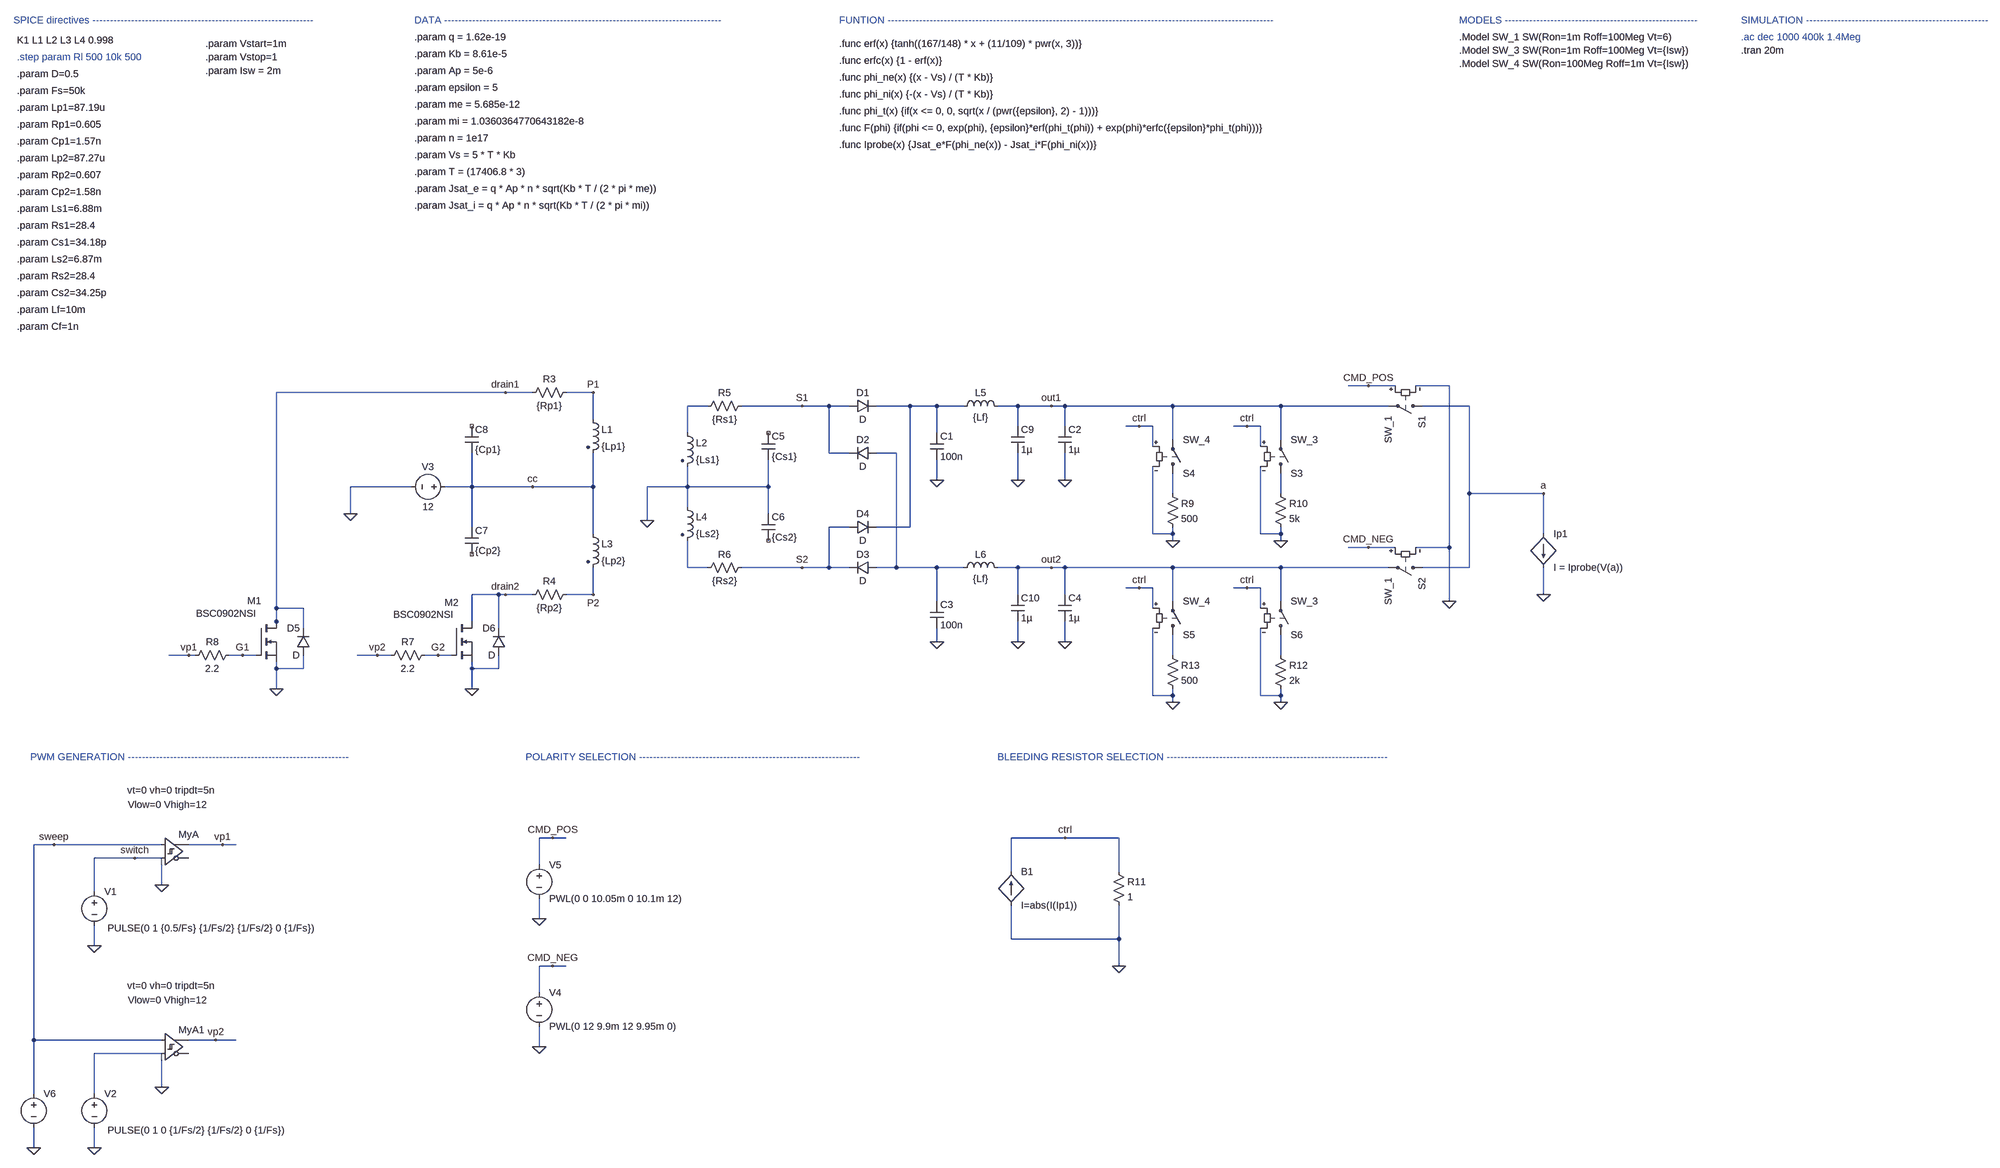
[diagram p0: schematic 6-probe_bps.asc]
6-probe_bps.asc, the LTspice schematic file:
Version 4.1
SHEET 1 4388 4032
WIRE 2064 592 2016 592
WIRE 2128 592 2064 592
WIRE 2256 592 2176 592
WIRE 16 608 -528 608
WIRE 80 608 16 608
WIRE 224 608 160 608
WIRE 496 640 448 640
WIRE 720 640 576 640
WIRE 784 640 720 640
WIRE 832 640 784 640
WIRE 976 640 896 640
WIRE 1040 640 976 640
WIRE 1104 640 1040 640
WIRE 1232 640 1184 640
WIRE 1312 640 1232 640
WIRE 1344 640 1312 640
WIRE 1600 640 1344 640
WIRE 1856 640 1600 640
WIRE 2112 640 1856 640
WIRE 2304 640 2192 640
WIRE 224 672 224 608
WIRE 1232 688 1232 640
WIRE 1344 688 1344 640
WIRE 1520 688 1488 688
WIRE 1552 688 1520 688
WIRE 1776 688 1744 688
WIRE 1808 688 1776 688
WIRE 448 704 448 640
WIRE 1040 704 1040 640
WIRE 1600 720 1600 640
WIRE 1856 720 1856 640
WIRE 1552 736 1552 688
WIRE 1808 736 1808 688
WIRE 784 752 784 640
WIRE 832 752 784 752
WIRE 944 752 896 752
WIRE 1040 816 1040 768
WIRE 1232 816 1232 752
WIRE 1344 816 1344 752
WIRE -208 832 -352 832
WIRE -64 832 -64 752
WIRE -64 832 -128 832
WIRE 80 832 -64 832
WIRE 224 832 224 752
WIRE 224 832 80 832
WIRE 448 832 448 784
WIRE 448 832 352 832
WIRE 640 832 640 768
WIRE 640 832 448 832
WIRE 1600 848 1600 800
WIRE 1856 848 1856 800
WIRE 2304 848 2304 640
WIRE 2480 848 2304 848
WIRE 448 880 448 832
WIRE -352 896 -352 832
WIRE 640 896 640 832
WIRE 352 912 352 832
WIRE -64 928 -64 832
WIRE 832 928 784 928
WIRE 976 928 976 640
WIRE 976 928 896 928
WIRE 224 944 224 832
WIRE 1552 944 1552 784
WIRE 1600 944 1600 928
WIRE 1600 944 1552 944
WIRE 1808 944 1808 784
WIRE 1856 944 1856 928
WIRE 1856 944 1808 944
WIRE 2480 944 2480 848
WIRE 1600 960 1600 944
WIRE 1856 960 1856 944
WIRE 2064 976 2016 976
WIRE 2128 976 2064 976
WIRE 2256 976 2256 592
WIRE 2256 976 2176 976
WIRE 448 1024 448 960
WIRE 496 1024 448 1024
WIRE 720 1024 576 1024
WIRE 784 1024 784 928
WIRE 784 1024 720 1024
WIRE 832 1024 784 1024
WIRE 944 1024 944 752
WIRE 944 1024 896 1024
WIRE 1040 1024 944 1024
WIRE 1104 1024 1040 1024
WIRE 1232 1024 1184 1024
WIRE 1312 1024 1232 1024
WIRE 1344 1024 1312 1024
WIRE 1600 1024 1344 1024
WIRE 1856 1024 1600 1024
WIRE 2112 1024 1856 1024
WIRE 2304 1024 2304 848
WIRE 2304 1024 2192 1024
WIRE 1520 1072 1488 1072
WIRE 1552 1072 1520 1072
WIRE 1776 1072 1744 1072
WIRE 1808 1072 1776 1072
WIRE 0 1088 -64 1088
WIRE 16 1088 0 1088
WIRE 80 1088 16 1088
WIRE 224 1088 224 1024
WIRE 224 1088 160 1088
WIRE 1232 1088 1232 1024
WIRE 1344 1088 1344 1024
WIRE 2480 1088 2480 1024
WIRE 1040 1104 1040 1024
WIRE 1600 1104 1600 1024
WIRE 1856 1104 1856 1024
WIRE 2256 1104 2256 976
WIRE -528 1120 -528 608
WIRE -464 1120 -528 1120
WIRE 1552 1120 1552 1072
WIRE 1808 1120 1808 1072
WIRE -528 1152 -528 1120
WIRE -64 1152 -64 1088
WIRE -528 1168 -528 1152
WIRE -464 1168 -464 1120
WIRE 0 1168 0 1088
WIRE 1040 1200 1040 1168
WIRE 1232 1200 1232 1152
WIRE 1344 1200 1344 1152
WIRE -736 1232 -784 1232
WIRE -720 1232 -736 1232
WIRE -608 1232 -640 1232
WIRE -576 1232 -608 1232
WIRE -288 1232 -336 1232
WIRE -256 1232 -288 1232
WIRE -144 1232 -176 1232
WIRE -112 1232 -144 1232
WIRE 1600 1232 1600 1184
WIRE 1856 1232 1856 1184
WIRE -528 1264 -528 1248
WIRE -464 1264 -464 1232
WIRE -464 1264 -528 1264
WIRE -64 1264 -64 1248
WIRE 0 1264 0 1232
WIRE 0 1264 -64 1264
WIRE -528 1312 -528 1264
WIRE -64 1312 -64 1264
WIRE 1552 1328 1552 1168
WIRE 1600 1328 1600 1312
WIRE 1600 1328 1552 1328
WIRE 1808 1328 1808 1168
WIRE 1856 1328 1856 1312
WIRE 1856 1328 1808 1328
WIRE 1600 1344 1600 1328
WIRE 1856 1344 1856 1328
WIRE 128 2016 96 2016
WIRE 160 2016 128 2016
WIRE 1344 2016 1216 2016
WIRE 1472 2016 1344 2016
WIRE -1056 2032 -1104 2032
WIRE -800 2032 -1056 2032
WIRE -656 2032 -736 2032
WIRE -624 2032 -656 2032
WIRE -864 2064 -960 2064
WIRE -800 2064 -864 2064
WIRE 96 2080 96 2016
WIRE 1216 2096 1216 2016
WIRE 1472 2096 1472 2016
WIRE -800 2128 -800 2080
WIRE -960 2144 -960 2064
WIRE 96 2208 96 2160
WIRE 1216 2256 1216 2176
WIRE 1472 2256 1472 2176
WIRE 1472 2256 1216 2256
WIRE -960 2272 -960 2224
WIRE 128 2320 96 2320
WIRE 160 2320 128 2320
WIRE 1472 2320 1472 2256
WIRE 96 2384 96 2320
WIRE -1104 2496 -1104 2032
WIRE -800 2496 -1104 2496
WIRE -672 2496 -736 2496
WIRE -624 2496 -672 2496
WIRE 96 2512 96 2464
WIRE -800 2528 -960 2528
WIRE -800 2608 -800 2544
WIRE -1104 2624 -1104 2496
WIRE -960 2624 -960 2528
WIRE -1104 2752 -1104 2704
WIRE -960 2752 -960 2704
FLAG 224 608 P1
FLAG 224 1088 P2
FLAG 352 912 0
FLAG -528 1312 0
FLAG -64 1312 0
FLAG -352 896 0
FLAG 16 608 drain1
FLAG 16 1088 drain2
FLAG -608 1232 G1
FLAG -144 1232 G2
FLAG 80 832 cc
FLAG 720 640 S1
FLAG 720 1024 S2
FLAG 1232 816 0
FLAG 1232 1200 0
FLAG -960 2272 0
FLAG -800 2128 0
FLAG -1056 2032 sweep
FLAG -864 2064 switch
FLAG -736 1232 vp1
FLAG -288 1232 vp2
FLAG -656 2032 vp1
FLAG -672 2496 vp2
FLAG 1312 640 out1
FLAG 1312 1024 out2
FLAG -800 2608 0
FLAG -960 2752 0
FLAG 2480 1088 0
FLAG 96 2208 0
FLAG 128 2016 CMD_POS
FLAG 2256 1104 0
FLAG 2064 592 CMD_POS
FLAG 2480 848 a
FLAG -1104 2752 0
FLAG 1472 2320 0
FLAG 1344 2016 ctrl
FLAG 1520 688 ctrl
FLAG 1776 688 ctrl
FLAG 1520 1072 ctrl
FLAG 1776 1072 ctrl
FLAG 1600 1344 0
FLAG 1856 1344 0
FLAG 1856 960 0
FLAG 1600 960 0
FLAG 96 2512 0
FLAG 128 2320 CMD_NEG
FLAG 2064 976 CMD_NEG
FLAG 1040 1200 0
FLAG 1040 816 0
FLAG 1344 816 0
FLAG 1344 1200 0
SYMBOL ind2 208 656 R0
SYMATTR InstName L1
SYMATTR Value {Lp1}
SYMATTR Type ind
SYMBOL ind2 432 688 R0
SYMATTR InstName L2
SYMATTR Value {Ls1}
SYMATTR Type ind
SYMBOL ind2 208 928 R0
SYMATTR InstName L3
SYMATTR Value {Lp2}
SYMATTR Type ind
SYMBOL ind2 432 864 R0
SYMATTR InstName L4
SYMATTR Value {Ls2}
SYMATTR Type ind
SYMBOL diode 832 656 R270
WINDOW 0 32 32 VTop 2
WINDOW 3 0 32 VBottom 2
SYMATTR InstName D1
SYMBOL diode 896 736 R90
WINDOW 0 0 32 VBottom 2
WINDOW 3 32 32 VTop 2
SYMATTR InstName D2
SYMBOL diode 896 1008 R90
WINDOW 0 0 32 VBottom 2
WINDOW 3 32 32 VTop 2
SYMATTR InstName D3
SYMBOL diode 832 944 R270
WINDOW 0 32 32 VTop 2
WINDOW 3 0 32 VBottom 2
SYMATTR InstName D4
SYMBOL cap 1024 704 R0
SYMATTR InstName C1
SYMATTR Value 100n
SYMBOL cap 1024 1104 R0
SYMATTR InstName C3
SYMATTR Value 100n
SYMBOL res 176 592 R90
WINDOW 0 0 56 VBottom 2
WINDOW 3 32 56 VTop 2
SYMATTR InstName R3
SYMATTR Value {Rp1}
SYMBOL res 176 1072 R90
WINDOW 0 0 56 VBottom 2
WINDOW 3 32 56 VTop 2
SYMATTR InstName R4
SYMATTR Value {Rp2}
SYMBOL res 592 624 R90
WINDOW 0 0 56 VBottom 2
WINDOW 3 32 56 VTop 2
SYMATTR InstName R5
SYMATTR Value {Rs1}
SYMBOL res 592 1008 R90
WINDOW 0 0 56 VBottom 2
WINDOW 3 32 56 VTop 2
SYMATTR InstName R6
SYMATTR Value {Rs2}
SYMBOL cap 624 704 R0
SYMATTR InstName C5
SYMATTR Value {Cs1}
SYMBOL cap 624 896 R0
SYMATTR InstName C6
SYMATTR Value {Cs2}
SYMBOL voltage -960 2128 R0
WINDOW 3 31 102 Left 2
WINDOW 123 0 0 Left 0
WINDOW 39 24 46 Left 2
SYMATTR Value PULSE(0 1 {0.5/Fs} {1/Fs/2} {1/Fs/2} 0 {1/Fs})
SYMATTR InstName V1
SYMBOL voltage -112 832 R90
WINDOW 0 -32 56 VBottom 2
WINDOW 3 32 56 VTop 2
WINDOW 123 0 0 Left 0
WINDOW 39 0 0 Left 0
SYMATTR InstName V3
SYMATTR Value 12
SYMBOL nmos -576 1152 R0
WINDOW 0 -21 -49 Left 2
WINDOW 3 -143 -19 Left 2
SYMATTR InstName M1
SYMATTR Value BSC0902NSI
SYMBOL nmos -112 1152 R0
WINDOW 0 -17 -45 Left 2
WINDOW 3 -138 -17 Left 2
SYMATTR InstName M2
SYMATTR Value BSC0902NSI
SYMBOL res -160 1216 R90
WINDOW 0 0 56 VBottom 2
WINDOW 3 32 56 VTop 2
SYMATTR InstName R7
SYMATTR Value 2.2
SYMBOL res -624 1216 R90
WINDOW 0 0 56 VBottom 2
WINDOW 3 32 56 VTop 2
SYMATTR InstName R8
SYMATTR Value 2.2
SYMBOL cap -80 928 R0
SYMATTR InstName C7
SYMATTR Value {Cp2}
SYMBOL cap -80 688 R0
SYMATTR InstName C8
SYMATTR Value {Cp1}
SYMBOL diode -448 1232 R180
WINDOW 0 24 64 Left 2
WINDOW 3 24 0 Left 2
SYMATTR InstName D5
SYMBOL diode 16 1232 R180
WINDOW 0 24 64 Left 2
WINDOW 3 24 0 Left 2
SYMATTR InstName D6
SYMBOL ind 1088 656 R270
WINDOW 0 32 56 VTop 2
WINDOW 3 5 56 VBottom 2
SYMATTR InstName L5
SYMATTR Value {Lf}
SYMBOL ind 1088 1040 R270
WINDOW 0 32 56 VTop 2
WINDOW 3 5 56 VBottom 2
SYMATTR InstName L6
SYMATTR Value {Lf}
SYMBOL cap 1216 688 R0
SYMATTR InstName C9
SYMATTR Value 1µ
SYMBOL cap 1216 1088 R0
SYMATTR InstName C10
SYMATTR Value 1µ
SYMBOL Digital\\diffschmitt -800 1984 R0
WINDOW 3 -82 -81 Left 2
WINDOW 123 -80 -47 Left 2
SYMATTR Value vt=0 vh=0 tripdt=5n
SYMATTR Value2 Vlow=0 Vhigh=12
SYMATTR InstName MyA
SYMBOL Digital\\diffschmitt -800 2448 R0
WINDOW 3 -82 -81 Left 2
WINDOW 123 -80 -47 Left 2
SYMATTR Value vt=0 vh=0 tripdt=5n
SYMATTR Value2 Vlow=0 Vhigh=12
SYMATTR InstName MyA1
SYMBOL voltage -960 2608 R0
WINDOW 3 31 102 Left 2
WINDOW 123 0 0 Left 0
WINDOW 39 24 46 Left 2
SYMATTR Value PULSE(0 1 0 {1/Fs/2} {1/Fs/2} 0 {1/Fs})
SYMATTR InstName V2
SYMBOL bi 2480 944 R0
SYMATTR InstName Ip1
SYMATTR Value I = Iprobe(V(a))
SYMBOL voltage 96 2064 R0
WINDOW 123 0 0 Left 0
WINDOW 39 0 0 Left 0
SYMATTR InstName V5
SYMATTR Value PWL(0 0 10.05m 0 10.1m 12)
SYMBOL sw 2208 640 R90
SYMATTR InstName S1
SYMATTR Value SW_1
SYMBOL sw 2208 1024 R90
SYMATTR InstName S2
SYMATTR Value SW_1
SYMBOL voltage -1104 2608 R0
WINDOW 123 0 0 Left 0
WINDOW 39 0 0 Left 0
WINDOW 3 24 96 Invisible 2
SYMATTR Value PWL(0 {Vstart} 3.4m {0.499*Vstop} 4m {Vstart} 10m {Vstart} 13.4m {0.499*Vstop} 14m {Vstart})
SYMATTR InstName V6
SYMBOL bi2 1216 2096 R0
SYMATTR InstName B1
SYMATTR Value I=abs(I(Ip1))
SYMBOL res 1456 2080 R0
SYMATTR InstName R11
SYMATTR Value 1
SYMBOL sw 1600 816 M180
SYMATTR InstName S4
SYMATTR Value SW_4
SYMBOL sw 1856 816 M180
SYMATTR InstName S3
SYMATTR Value SW_3
SYMBOL sw 1600 1200 M180
SYMATTR InstName S5
SYMATTR Value SW_4
SYMBOL sw 1856 1200 M180
SYMATTR InstName S6
SYMATTR Value SW_3
SYMBOL res 1584 832 R0
SYMATTR InstName R9
SYMATTR Value 500
SYMBOL res 1840 832 R0
SYMATTR InstName R10
SYMATTR Value 5k
SYMBOL res 1840 1216 R0
SYMATTR InstName R12
SYMATTR Value 2k
SYMBOL res 1584 1216 R0
SYMATTR InstName R13
SYMATTR Value 500
SYMBOL voltage 96 2368 R0
WINDOW 123 0 0 Left 0
WINDOW 39 0 0 Left 0
SYMATTR InstName V4
SYMATTR Value PWL(0 12 9.9m 12 9.95m 0)
SYMBOL cap 1328 688 R0
SYMATTR InstName C2
SYMATTR Value 1µ
SYMBOL cap 1328 1088 R0
SYMATTR InstName C4
SYMATTR Value 1µ
TEXT -1152 -480 Left 2 ;SPICE directives ---------------------------------------------------------------
TEXT 3144 -440 Left 2 ;.ac dec 1000 400k 1.4Meg
TEXT 3144 -480 Left 2 ;SIMULATION ----------------------------------------------------
TEXT 3144 -408 Left 2 !.tran 20m
TEXT -1144 -432 Left 2 !K1 L1 L2 L3 L4 0.998
TEXT -1144 -272 Left 2 !.param Lp1=87.19u
TEXT -1144 -192 Left 2 !.param Cp1=1.57n
TEXT -1144 -232 Left 2 !.param Rp1=0.605
TEXT -1144 -152 Left 2 !.param Lp2=87.27u
TEXT -1144 -72 Left 2 !.param Cp2=1.58n
TEXT -1144 -112 Left 2 !.param Rp2=0.607
TEXT -1144 -32 Left 2 !.param Ls1=6.88m
TEXT -1144 48 Left 2 !.param Cs1=34.18p
TEXT -1144 8 Left 2 !.param Rs1=28.4
TEXT -1144 88 Left 2 !.param Ls2=6.87m
TEXT -1144 168 Left 2 !.param Cs2=34.25p
TEXT -1144 128 Left 2 !.param Rs2=28.4
TEXT -1144 -312 Left 2 !.param Fs=50k
TEXT -1144 -352 Left 2 !.param D=0.5
TEXT -1144 -392 Left 2 ;.step param Rl 500 10k 500
TEXT -1144 208 Left 2 !.param Lf=10m
TEXT -1144 248 Left 2 !.param Cf=1n
TEXT 808 -224 Left 2 !.func F(phi) {if(phi <= 0, exp(phi), {epsilon}*erf(phi_t(phi)) + exp(phi)*erfc({epsilon}*phi_t(phi)))}
TEXT 808 -424 Left 2 !.func erf(x) {tanh((167/148) * x + (11/109) * pwr(x, 3))}
TEXT 808 -480 Left 2 ;FUNTION --------------------------------------------------------------------------------------------------------------
TEXT 808 -384 Left 2 !.func erfc(x) {1 - erf(x)}
TEXT 808 -264 Left 2 !.func phi_t(x) {if(x <= 0, 0, sqrt(x / (pwr({epsilon}, 2) - 1)))}
TEXT -200 -120 Left 2 !.param T = (17406.8 * 3)
TEXT -200 -160 Left 2 !.param Vs = 5 * T * Kb
TEXT -200 -360 Left 2 !.param Ap = 5e-6
TEXT -200 -320 Left 2 !.param epsilon = 5
TEXT -200 -280 Left 2 !.param me = 5.685e-12
TEXT -200 -240 Left 2 !.param mi = 1.0360364770643182e-8
TEXT -200 -200 Left 2 !.param n = 1e17
TEXT -200 -80 Left 2 !.param Jsat_e = q * Ap * n * sqrt(Kb * T / (2 * pi * me))
TEXT -200 -40 Left 2 !.param Jsat_i = q * Ap * n * sqrt(Kb * T / (2 * pi * mi))
TEXT -200 -480 Left 2 ;DATA -------------------------------------------------------------------------------
TEXT 808 -344 Left 2 !.func phi_ne(x) {(x - Vs) / (T * Kb)}
TEXT -200 -440 Left 2 !.param q = 1.62e-19
TEXT 808 -304 Left 2 !.func phi_ni(x) {-(x - Vs) / (T * Kb)}
TEXT -200 -400 Left 2 !.param Kb = 8.61e-5
TEXT 808 -184 Left 2 !.func Iprobe(x) {Jsat_e*F(phi_ne(x)) - Jsat_i*F(phi_ni(x))}
TEXT -696 -424 Left 2 !.param Vstart=1m
TEXT -696 -392 Left 2 !.param Vstop=1
TEXT 2280 -440 Left 2 !.Model SW_1 SW(Ron=1m Roff=100Meg Vt=6)
TEXT 2280 -408 Left 2 !.Model SW_3 SW(Ron=1m Roff=100Meg Vt={Isw})
TEXT 2280 -376 Left 2 !.Model SW_4 SW(Ron=100Meg Roff=1m Vt={Isw})
TEXT -696 -360 Left 2 !.param Isw = 2m
TEXT 2280 -480 Left 2 ;MODELS -------------------------------------------------------
TEXT -1112 1824 Left 2 ;PWM GENERATION ---------------------------------------------------------------
TEXT 64 1824 Left 2 ;POLARITY SELECTION ---------------------------------------------------------------
TEXT 1184 1824 Left 2 ;BLEEDING RESISTOR SELECTION ---------------------------------------------------------------

The netlist it stands for:
* 6-probe_bps.asc
L1 P1 cc {Lp1}
L2 N001 0 {Ls1}
L3 cc P2 {Lp2}
L4 0 N006 {Ls2}
D1 S1 N002 D
D2 N003 S1 D
D3 N003 S2 D
D4 S2 N002 D
C1 N002 0 100n
C3 N003 0 100n
R3 P1 drain1 {Rp1}
R4 P2 drain2 {Rp2}
R5 S1 N001 {Rs1}
R6 S2 N006 {Rs2}
C5 NC_01 0 {Cs1}
C6 0 NC_02 {Cs2}
V1 switch 0 PULSE(0 1 {0.5/Fs} {1/Fs/2} {1/Fs/2} 0 {1/Fs})
V3 cc 0 12
M1 drain1 G1 0 0 BSC0902NSI
M2 drain2 G2 0 0 BSC0902NSI
R7 G2 vp2 2.2
R8 G1 vp1 2.2
C7 cc NC_03 {Cp2}
C8 NC_04 cc {Cp1}
D5 0 drain1 D
D6 0 drain2 D
L5 N002 out1 {Lf}
L6 N003 out2 {Lf}
C9 out1 0 1µ
C10 out2 0 1µ
A§MyA sweep switch 0 0 0 0 vp1 0 SCHMITT vt=0 vh=0 tripdt=5n Vlow=0 Vhigh=12
A§MyA1 sweep N009 0 0 0 0 vp2 0 SCHMITT vt=0 vh=0 tripdt=5n Vlow=0 Vhigh=12
V2 N009 0 PULSE(0 1 0 {1/Fs/2} {1/Fs/2} 0 {1/Fs})
B§Ip1 a 0 I = Iprobe(V(a))
V5 CMD_POS 0 PWL(0 0 10.05m 0 10.1m 12)
S1 a out1 CMD_POS 0 SW_1
S2 a out2 CMD_NEG 0 SW_1
V6 sweep 0 PWL(0 {Vstart} 3.4m {0.499*Vstop} 4m {Vstart} 10m {Vstart} 13.4m {0.499*Vstop} 14m {Vstart})
B1 0 ctrl I=abs(I(Ip1))
R11 ctrl 0 1
S4 N004 out1 ctrl 0 SW_4
S3 N005 out1 ctrl 0 SW_3
S5 N007 out2 ctrl 0 SW_4
S6 N008 out2 ctrl 0 SW_3
R9 N004 0 500
R10 N005 0 5k
R12 N008 0 2k
R13 N007 0 500
V4 CMD_NEG 0 PWL(0 12 9.9m 12 9.95m 0)
C2 out1 0 1µ
C4 out2 0 1µ
.model D D
.lib standard.dio
.model NMOS NMOS
.model PMOS PMOS
.lib standard.mos
* SPICE directives ---------------------------------------------------------------
* .ac dec 1000 400k 1.4Meg
* SIMULATION ----------------------------------------------------
.tran 20m
K1 L1 L2 L3 L4 0.998
.param Lp1=87.19u
.param Cp1=1.57n
.param Rp1=0.605
.param Lp2=87.27u
.param Cp2=1.58n
.param Rp2=0.607
.param Ls1=6.88m
.param Cs1=34.18p
.param Rs1=28.4
.param Ls2=6.87m
.param Cs2=34.25p
.param Rs2=28.4
.param Fs=50k
.param D=0.5
* .step param Rl 500 10k 500
.param Lf=10m
.param Cf=1n
.func F(phi) {if(phi <= 0, exp(phi), {epsilon}*erf(phi_t(phi)) + exp(phi)*erfc({epsilon}*phi_t(phi)))}
.func erf(x) {tanh((167/148) * x + (11/109) * pwr(x, 3))}
* FUNTION --------------------------------------------------------------------------------------------------------------
.func erfc(x) {1 - erf(x)}
.func phi_t(x) {if(x <= 0, 0, sqrt(x / (pwr({epsilon}, 2) - 1)))}
.param T = (17406.8 * 3)
.param Vs = 5 * T * Kb
.param Ap = 5e-6
.param epsilon = 5
.param me = 5.685e-12
.param mi = 1.0360364770643182e-8
.param n = 1e17
.param Jsat_e = q * Ap * n * sqrt(Kb * T / (2 * pi * me))
.param Jsat_i = q * Ap * n * sqrt(Kb * T / (2 * pi * mi))
* DATA -------------------------------------------------------------------------------
.func phi_ne(x) {(x - Vs) / (T * Kb)}
.param q = 1.62e-19
.func phi_ni(x) {-(x - Vs) / (T * Kb)}
.param Kb = 8.61e-5
.func Iprobe(x) {Jsat_e*F(phi_ne(x)) - Jsat_i*F(phi_ni(x))}
.param Vstart=1m
.param Vstop=1
.Model SW_1 SW(Ron=1m Roff=100Meg Vt=6)
.Model SW_3 SW(Ron=1m Roff=100Meg Vt={Isw})
.Model SW_4 SW(Ron=100Meg Roff=1m Vt={Isw})
.param Isw = 2m
* MODELS -------------------------------------------------------
* PWM GENERATION ---------------------------------------------------------------
* POLARITY SELECTION ---------------------------------------------------------------
* BLEEDING RESISTOR SELECTION ---------------------------------------------------------------
.backanno
.end